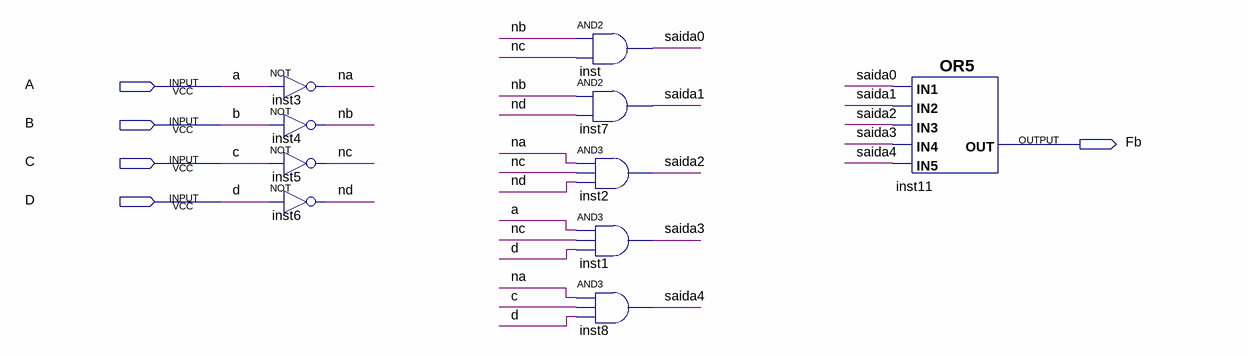
[diagram p0: schematic sheet]
// Quartus schematic FuncaoB.bdf as structural Verilog: 10 symbols, 5 pins
module FuncaoB (
  input  A,
  input  B,
  input  C,
  input  D,
  output Fb
);

  wire na, nb, nc, nd, saida0, saida1, saida2, saida3, saida4;

  not inst3 (na, A);
  not inst4 (nb, B);
  not inst5 (nc, C);
  not inst6 (nd, D);
  and inst (saida0, nb, nc);
  and inst7 (saida1, nb, nd);
  and inst2 (saida2, na, nc, nd);
  and inst1 (saida3, A, nc, D);
  and inst8 (saida4, na, C, D);
  or inst11 (Fb, saida0, saida1, saida2, saida3, saida4);
endmodule
